# EasyEDA Pro project Environmental_PCB_Group5.epro

# Schematic Schematic1
Board Name: Board1; Create Date: 2025-10-28; Page Name: P1; Project Name: Environmental PCB; Schematic Name: Schematic1; Update Date: 2025-11-02; Company: EasyEDA.com; Page Size: A4; Version: V1.0
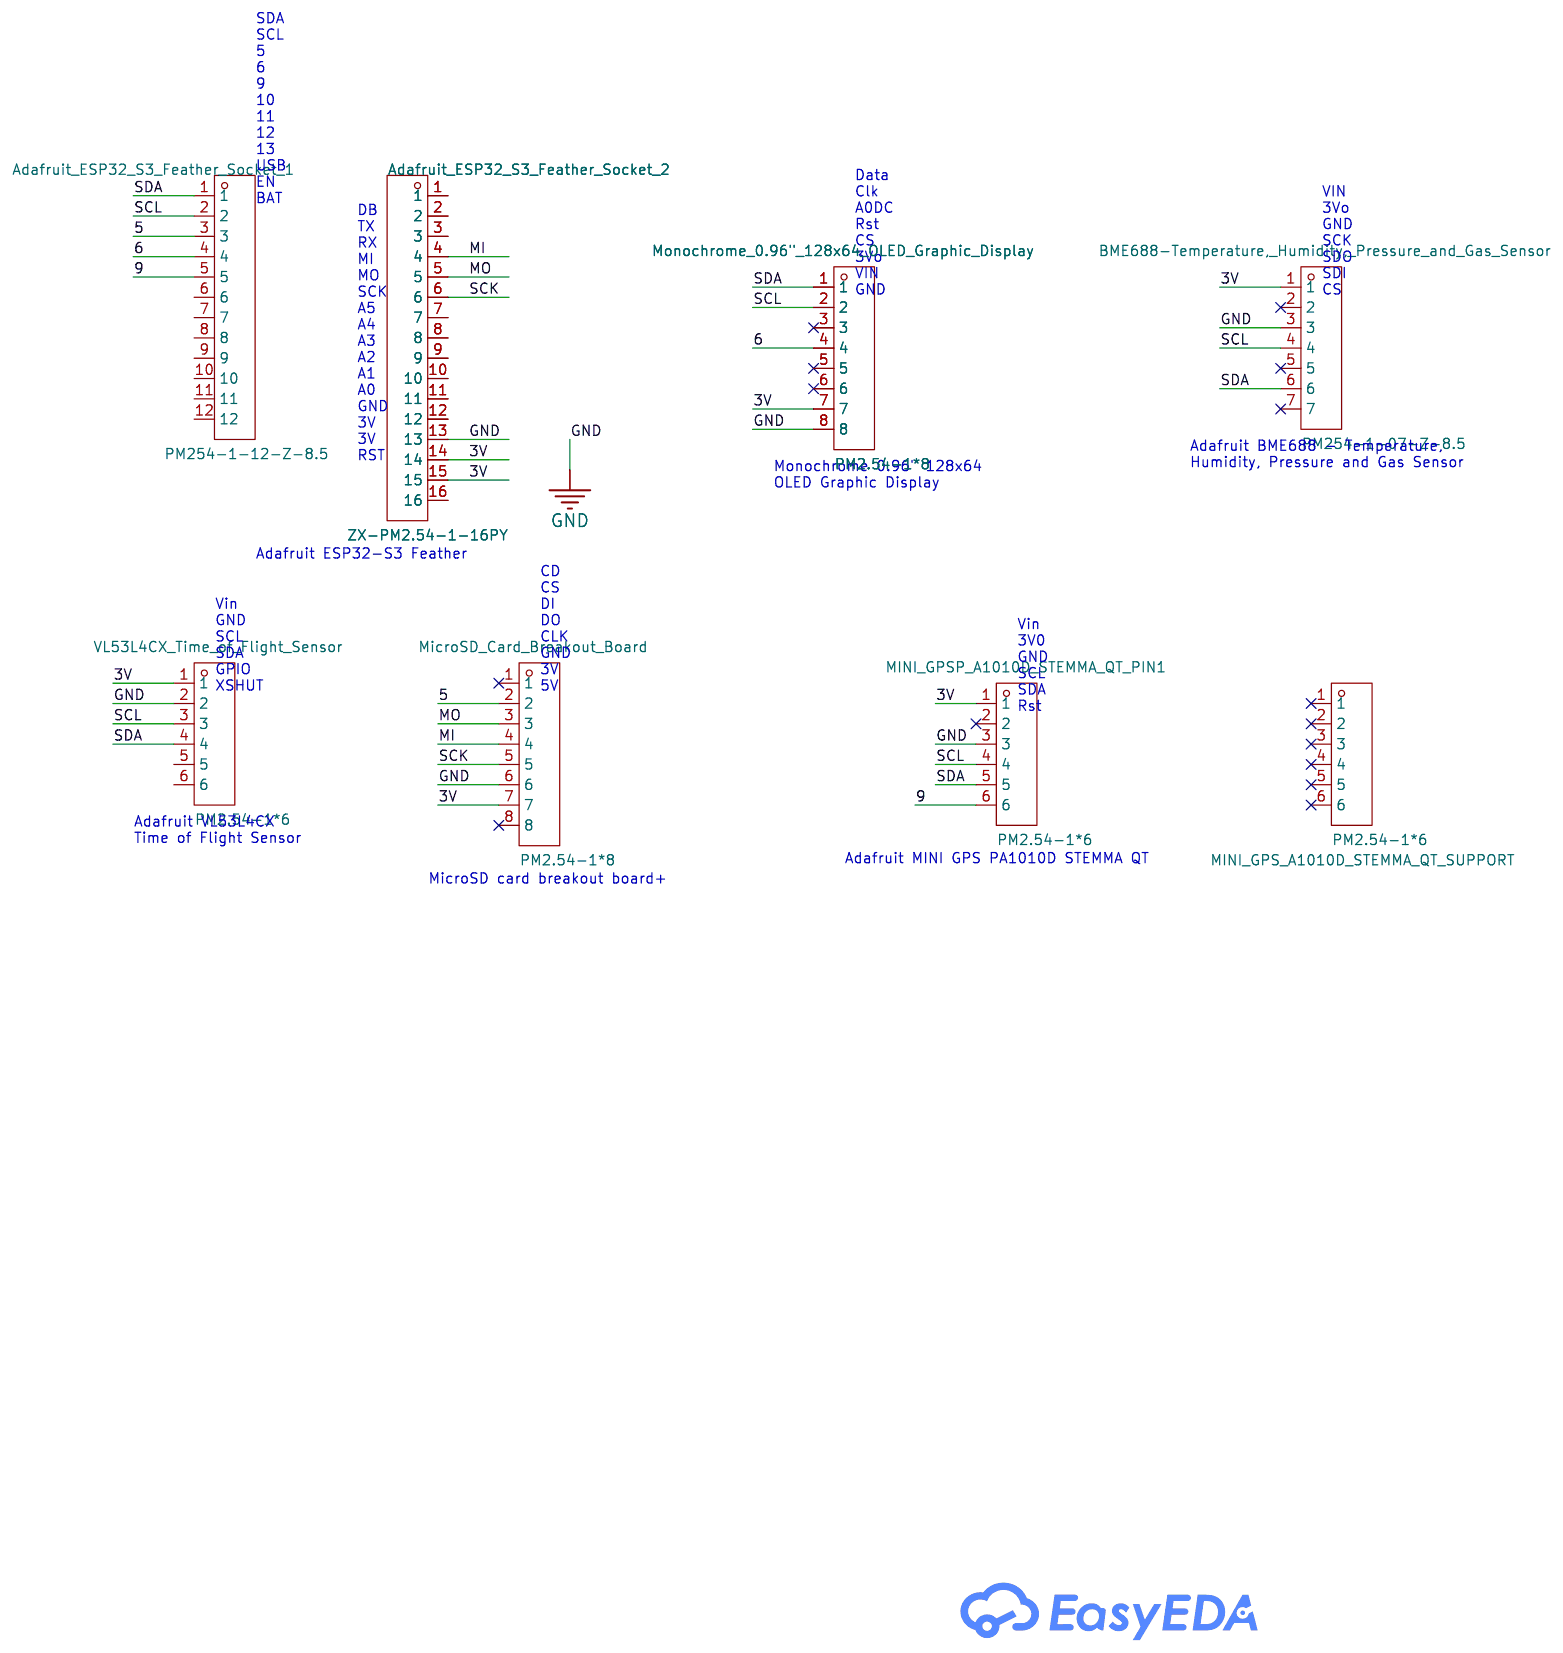
[diagram p0: schematic sheet]

## Parts
Adafruit_ESP32_S3_Feather_Socket_1  PM254-1-12-Z-8.5  [HDR-TH_12P-P2.54-V-F]
Adafruit_ESP32_S3_Feather_Socket_2  ZX-PM2.54-1-16PY  [HDR-TH_16P-P2.54-V-F-1]
BME688-Temperature,_Humidity,_Pressure_and_Gas_Sensor  PM254-1-07-Z-8.5  [HDR-TH_7P-P2.54-V-F]
MicroSD_Card_Breakout_Board  PM2.54-1*8  [HDR-TH_8P-P2.54-V-F]
MINI_GPS_A1010D_STEMMA_QT_SUPPORT  PM2.54-1*6  [HDR-TH_6P-P2.54-V-F_4]
MINI_GPSP_A1010D_STEMMA_QT_PIN1  PM2.54-1*6  [HDR-TH_6P-P2.54-V-F_4]
Monochrome_0.96"_128x64_OLED_Graphic_Display  PM2.54-1*8  [HDR-TH_8P-P2.54-V-F]
VL53L4CX_Time_of_Flight_Sensor  PM2.54-1*6  [HDR-TH_6P-P2.54-V-F_4]

## Library data of the parts
Adafruit_ESP32_S3_Feather_Socket_1 = PM254-1-12-Z-8.5: Holes Structure:1x12P Pitch:2.54mm Row Spacing:- Circular Hole / Square Hole:Square Hole Mounting Type:Through Hole Number of Rows:1 Number of Positions:12P Current Rating:3A Voltage Rating (Max):- Holes Direction:Top Insulation Height:8.5mm Contact Mater; LCSC Part Name: 1x12P 间距:2.54mm 直插; Supplier Part: C2897375; Manufacturer: HCTL(华灿天禄); Supplier Footprint: 插件,P=2.54mm; JLCPCB Part Class: Extended Part; Datasheet: https://item.szlcsc.com/datasheet/PM254-1-12-Z-8.5/3142380.html; Supplier: LCSC; Holes Structure: 1x12P; Pitch: 2.54mm; Circular Hole / Square Hole: Square Hole; Mounting Type: Through Hole; Number of Rows: 1; Number of Positions: 12P; Current Rating: 3A; Holes Direction: Top; Insulation Height: 8.5mm; Contact Material: Copper Alloy; Operating Temperature: -40℃~+105℃
Adafruit_ESP32_S3_Feather_Socket_2 = ZX-PM2.54-1-16PY: Holes Structure:1x16P Pitch:2.54mm Row Spacing:- Circular Hole / Square Hole:Square Hole Mounting Type:Through Hole Number of Rows:1 Number of Positions:16P Current Rating:3A Voltage Rating (Max):- Holes Direction:Top Insulation Height:8.5mm Contact Mater; LCSC Part Name: 1x16P 间距:2.54mm 直插; Supplier Part: C7499334; Manufacturer: Megastar(兆星); Supplier Footprint: 插件,P=2.54mm; JLCPCB Part Class: Extended Part; Datasheet: https://item.szlcsc.com/datasheet/ZX-PM2.54-1-16PY/8573995.html; Supplier: LCSC; Holes Structure: 1x16P; Pitch: 2.54mm; Circular Hole / Square Hole: Square Hole; Mounting Type: Through Hole; Number of Rows: 1; Number of Positions: 16P; Current Rating: 3A; Holes Direction: Top; Insulation Height: 8.5mm; Contact Plating: Gold; Operating Temperature: -40℃~+105℃; PIN Length: 3.2mm
BME688-Temperature,_Humidity,_Pressure_and_Gas_Sensor = PM254-1-07-Z-8.5: Holes Structure:1x7P Pitch:2.54mm Row Spacing:- Circular Hole / Square Hole:Square Hole Mounting Type:Through Hole Number of Rows:1 Number of Positions:7P Current Rating:3A Voltage Rating (Max):- Holes Direction:Top Insulation Height:8.5mm Contact Materia; LCSC Part Name: 1x7P 间距:2.54mm 直插; Supplier Part: C2897370; Manufacturer: HCTL(华灿天禄); Supplier Footprint: 插件,P=2.54mm; JLCPCB Part Class: Extended Part; Datasheet: https://item.szlcsc.com/datasheet/PM254-1-07-Z-8.5/3142375.html; Supplier: LCSC; Holes Structure: 1x7P; Pitch: 2.54mm; Circular Hole / Square Hole: Square Hole; Mounting Type: Through Hole; Number of Rows: 1; Number of Positions: 7P; Current Rating: 3A; Holes Direction: Top; Insulation Height: 8.5mm; Contact Material: Copper Alloy; Operating Temperature: -40℃~+105℃
MicroSD_Card_Breakout_Board Monochrome_0.96"_128x64_OLED_Graphic_Display = PM2.54-1*8: Holes Structure:1x8P Pitch:2.54mm Row Spacing:2.54mm Circular Hole / Square Hole:Square Hole Mounting Type:Through Hole Number of Rows:1 Number of Positions:8P Current Rating:2.5A Holes Direction:Top Insulation Height:8.5mm Operating Temperature:-40℃~+105; LCSC Part Name: 间距:2.54mm 1x8P 直插; Supplier Part: C5224027; Manufacturer: ZHOURI(洲日); Supplier Footprint: 插件,P=2.54mm; JLCPCB Part Class: Extended Part; Datasheet: https://item.szlcsc.com/datasheet/PM2.54-1*8/5925206.html; Supplier: LCSC; Holes Structure: 1x8P; Pitch: 2.54mm; Row Spacing: 2.54mm; Circular Hole / Square Hole: Square Hole; Mounting Type: Through Hole; Number of Rows: 1; Number of Positions: 8P; Current Rating: 2.5A; Holes Direction: Top; Insulation Height: 8.5mm; Operating Temperature: -40℃~+105℃
MINI_GPS_A1010D_STEMMA_QT_SUPPORT MINI_GPSP_A1010D_STEMMA_QT_PIN1 VL53L4CX_Time_of_Flight_Sensor = PM2.54-1*6: Holes Structure:1x6P Pitch:2.54mm Row Spacing:2.54mm Circular Hole / Square Hole:Square Hole Mounting Type:Through Hole Number of Rows:1 Number of Positions:6P Current Rating:2.5A Holes Direction:Top Insulation Height:8.5mm Operating Temperature:-40℃~+105; LCSC Part Name: 间距:2.54mm 1x6P 直插; Supplier Part: C5224026; Manufacturer: ZHOURI(洲日); Supplier Footprint: 插件,P=2.54mm; JLCPCB Part Class: Extended Part; Datasheet: https://item.szlcsc.com/datasheet/PM2.54-1*6/5925205.html; Supplier: LCSC; Holes Structure: 1x6P; Pitch: 2.54mm; Row Spacing: 2.54mm; Circular Hole / Square Hole: Square Hole; Mounting Type: Through Hole; Number of Rows: 1; Number of Positions: 6P; Current Rating: 2.5A; Holes Direction: Top; Insulation Height: 8.5mm; Operating Temperature: -40℃~+105℃

## Nets
3V: Adafruit_ESP32_S3_Feather_Socket_2.14 Adafruit_ESP32_S3_Feather_Socket_2.15 BME688-Temperature,_Humidity,_Pressure_and_Gas_Sensor.1 MicroSD_Card_Breakout_Board.7 MINI_GPSP_A1010D_STEMMA_QT_PIN1.1 Monochrome_0.96"_128x64_OLED_Graphic_Display.7 VL53L4CX_Time_of_Flight_Sensor.1
GND: Adafruit_ESP32_S3_Feather_Socket_2.13 BME688-Temperature,_Humidity,_Pressure_and_Gas_Sensor.3 MicroSD_Card_Breakout_Board.6 MINI_GPSP_A1010D_STEMMA_QT_PIN1.3 Monochrome_0.96"_128x64_OLED_Graphic_Display.8 VL53L4CX_Time_of_Flight_Sensor.2
5: Adafruit_ESP32_S3_Feather_Socket_1.3 MicroSD_Card_Breakout_Board.2
6: Adafruit_ESP32_S3_Feather_Socket_1.4 Monochrome_0.96"_128x64_OLED_Graphic_Display.4
9: Adafruit_ESP32_S3_Feather_Socket_1.5 MINI_GPSP_A1010D_STEMMA_QT_PIN1.6
MI: Adafruit_ESP32_S3_Feather_Socket_2.4 MicroSD_Card_Breakout_Board.4
MO: Adafruit_ESP32_S3_Feather_Socket_2.5 MicroSD_Card_Breakout_Board.3
SCK: Adafruit_ESP32_S3_Feather_Socket_2.6 MicroSD_Card_Breakout_Board.5
SCL: Adafruit_ESP32_S3_Feather_Socket_1.2 BME688-Temperature,_Humidity,_Pressure_and_Gas_Sensor.4 MINI_GPSP_A1010D_STEMMA_QT_PIN1.4 Monochrome_0.96"_128x64_OLED_Graphic_Display.2 VL53L4CX_Time_of_Flight_Sensor.3
SDA: Adafruit_ESP32_S3_Feather_Socket_1.1 BME688-Temperature,_Humidity,_Pressure_and_Gas_Sensor.6 MINI_GPSP_A1010D_STEMMA_QT_PIN1.5 Monochrome_0.96"_128x64_OLED_Graphic_Display.1 VL53L4CX_Time_of_Flight_Sensor.4

Not connected (* = marked no-connect by the designer): Adafruit_ESP32_S3_Feather_Socket_1 6 7 8 9 10 11 12; Adafruit_ESP32_S3_Feather_Socket_2 1 2 3 7 8 9 10 11 12 16; BME688-Temperature,_Humidity,_Pressure_and_Gas_Sensor 2* 5* 7*; MicroSD_Card_Breakout_Board 1* 8*; MINI_GPS_A1010D_STEMMA_QT_SUPPORT 1* 2* 3* 4* 5* 6*; MINI_GPSP_A1010D_STEMMA_QT_PIN1 2*; Monochrome_0.96"_128x64_OLED_Graphic_Display 3* 5* 6*; VL53L4CX_Time_of_Flight_Sensor 5 6

## Notes on the sheet
- SDA
  SCL
  5
  6
  9
  10
  11
  12
  13
  USB
  EN
  BAT
- DB
  TX
  RX
  MI
  MO
  SCK
  A5
  A4
  A3
  A2
  A1
  A0
  GND
  3V
  3V
  RST
- Data
  Clk
  A0DC
  Rst
  CS
  3Vo
  VIN
  GND
- VIN
  3Vo
  GND
  SCK
  SDO
  SDI
  CS
- Adafruit BME688 - Temperature,
  Humidity, Pressure and Gas Sensor
- Monochrome 0.96" 128x64
  OLED Graphic Display
- Adafruit ESP32-S3 Feather
- Vin
  GND
  SCL
  SDA
  GPIO
  XSHUT
- CD
  CS
  DI
  DO
  CLK
  GND
  3V
  5V
- Vin
  3V0
  GND
  SCL
  SDA
  Rst
- Adafruit VL53L4CX
  Time of Flight Sensor
- MicroSD card breakout board+
- Adafruit MINI GPS PA1010D STEMMA QT

# Board PCB1
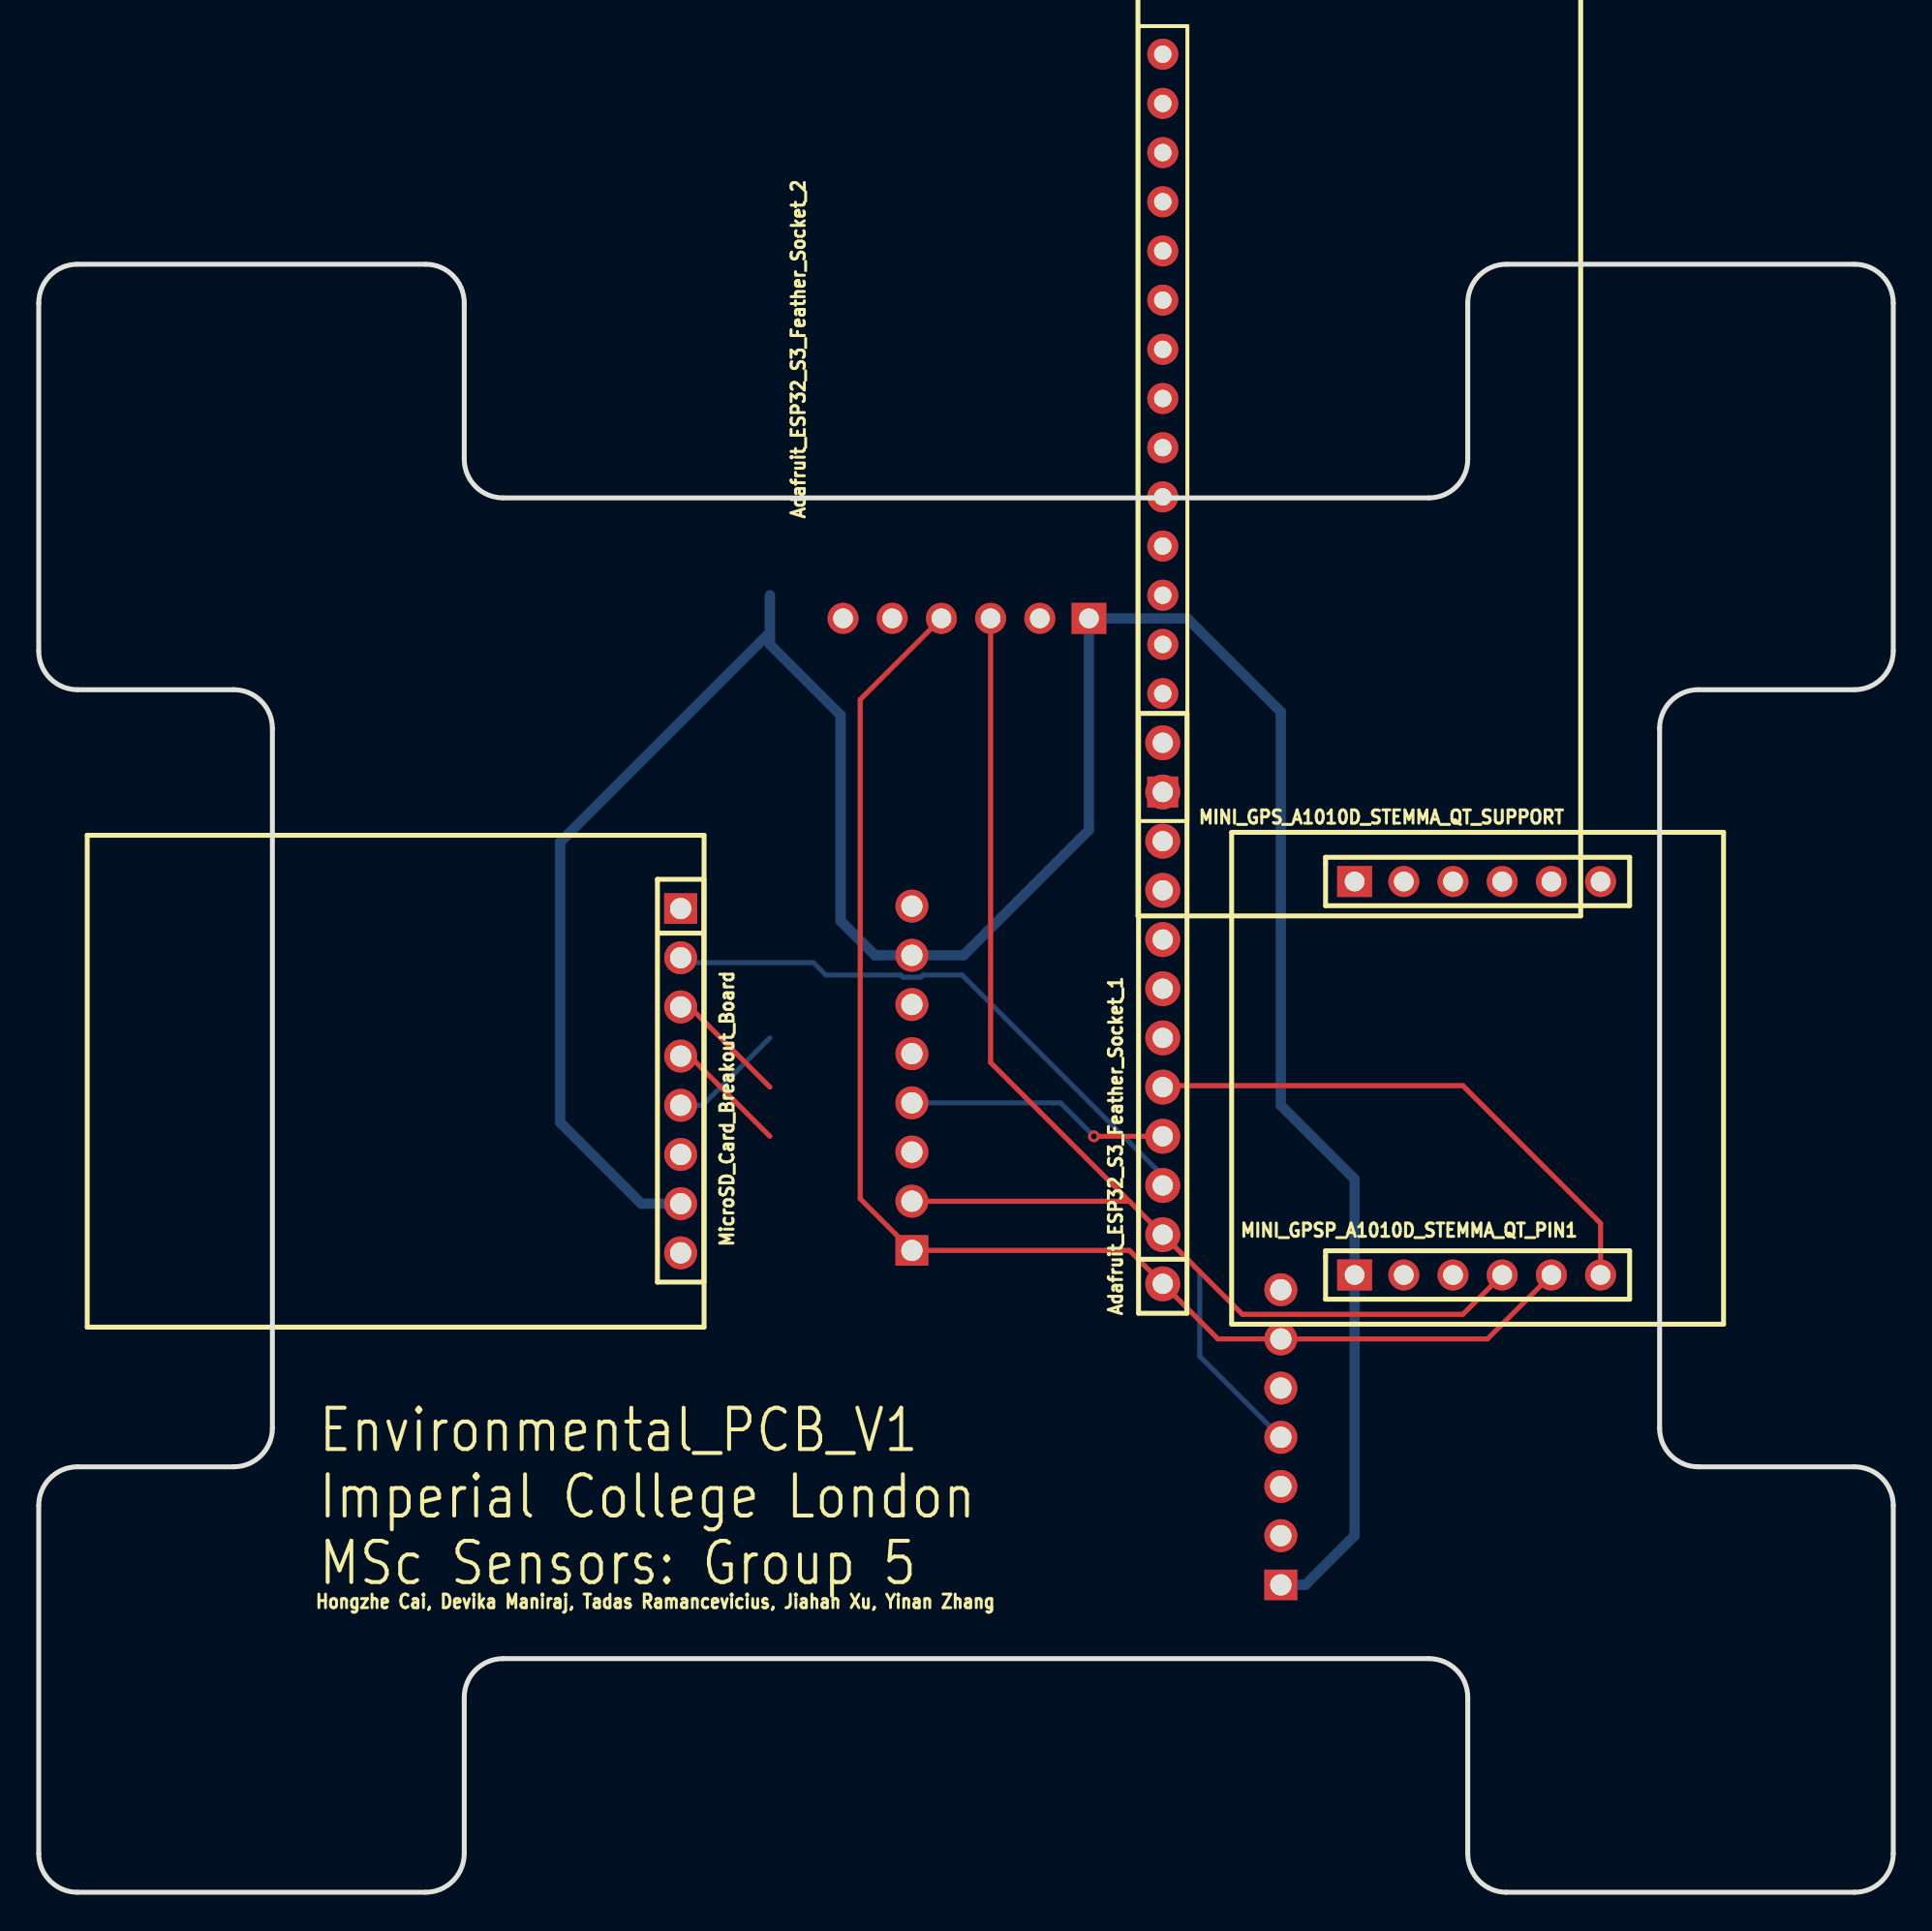
[diagram p1: board, top side]
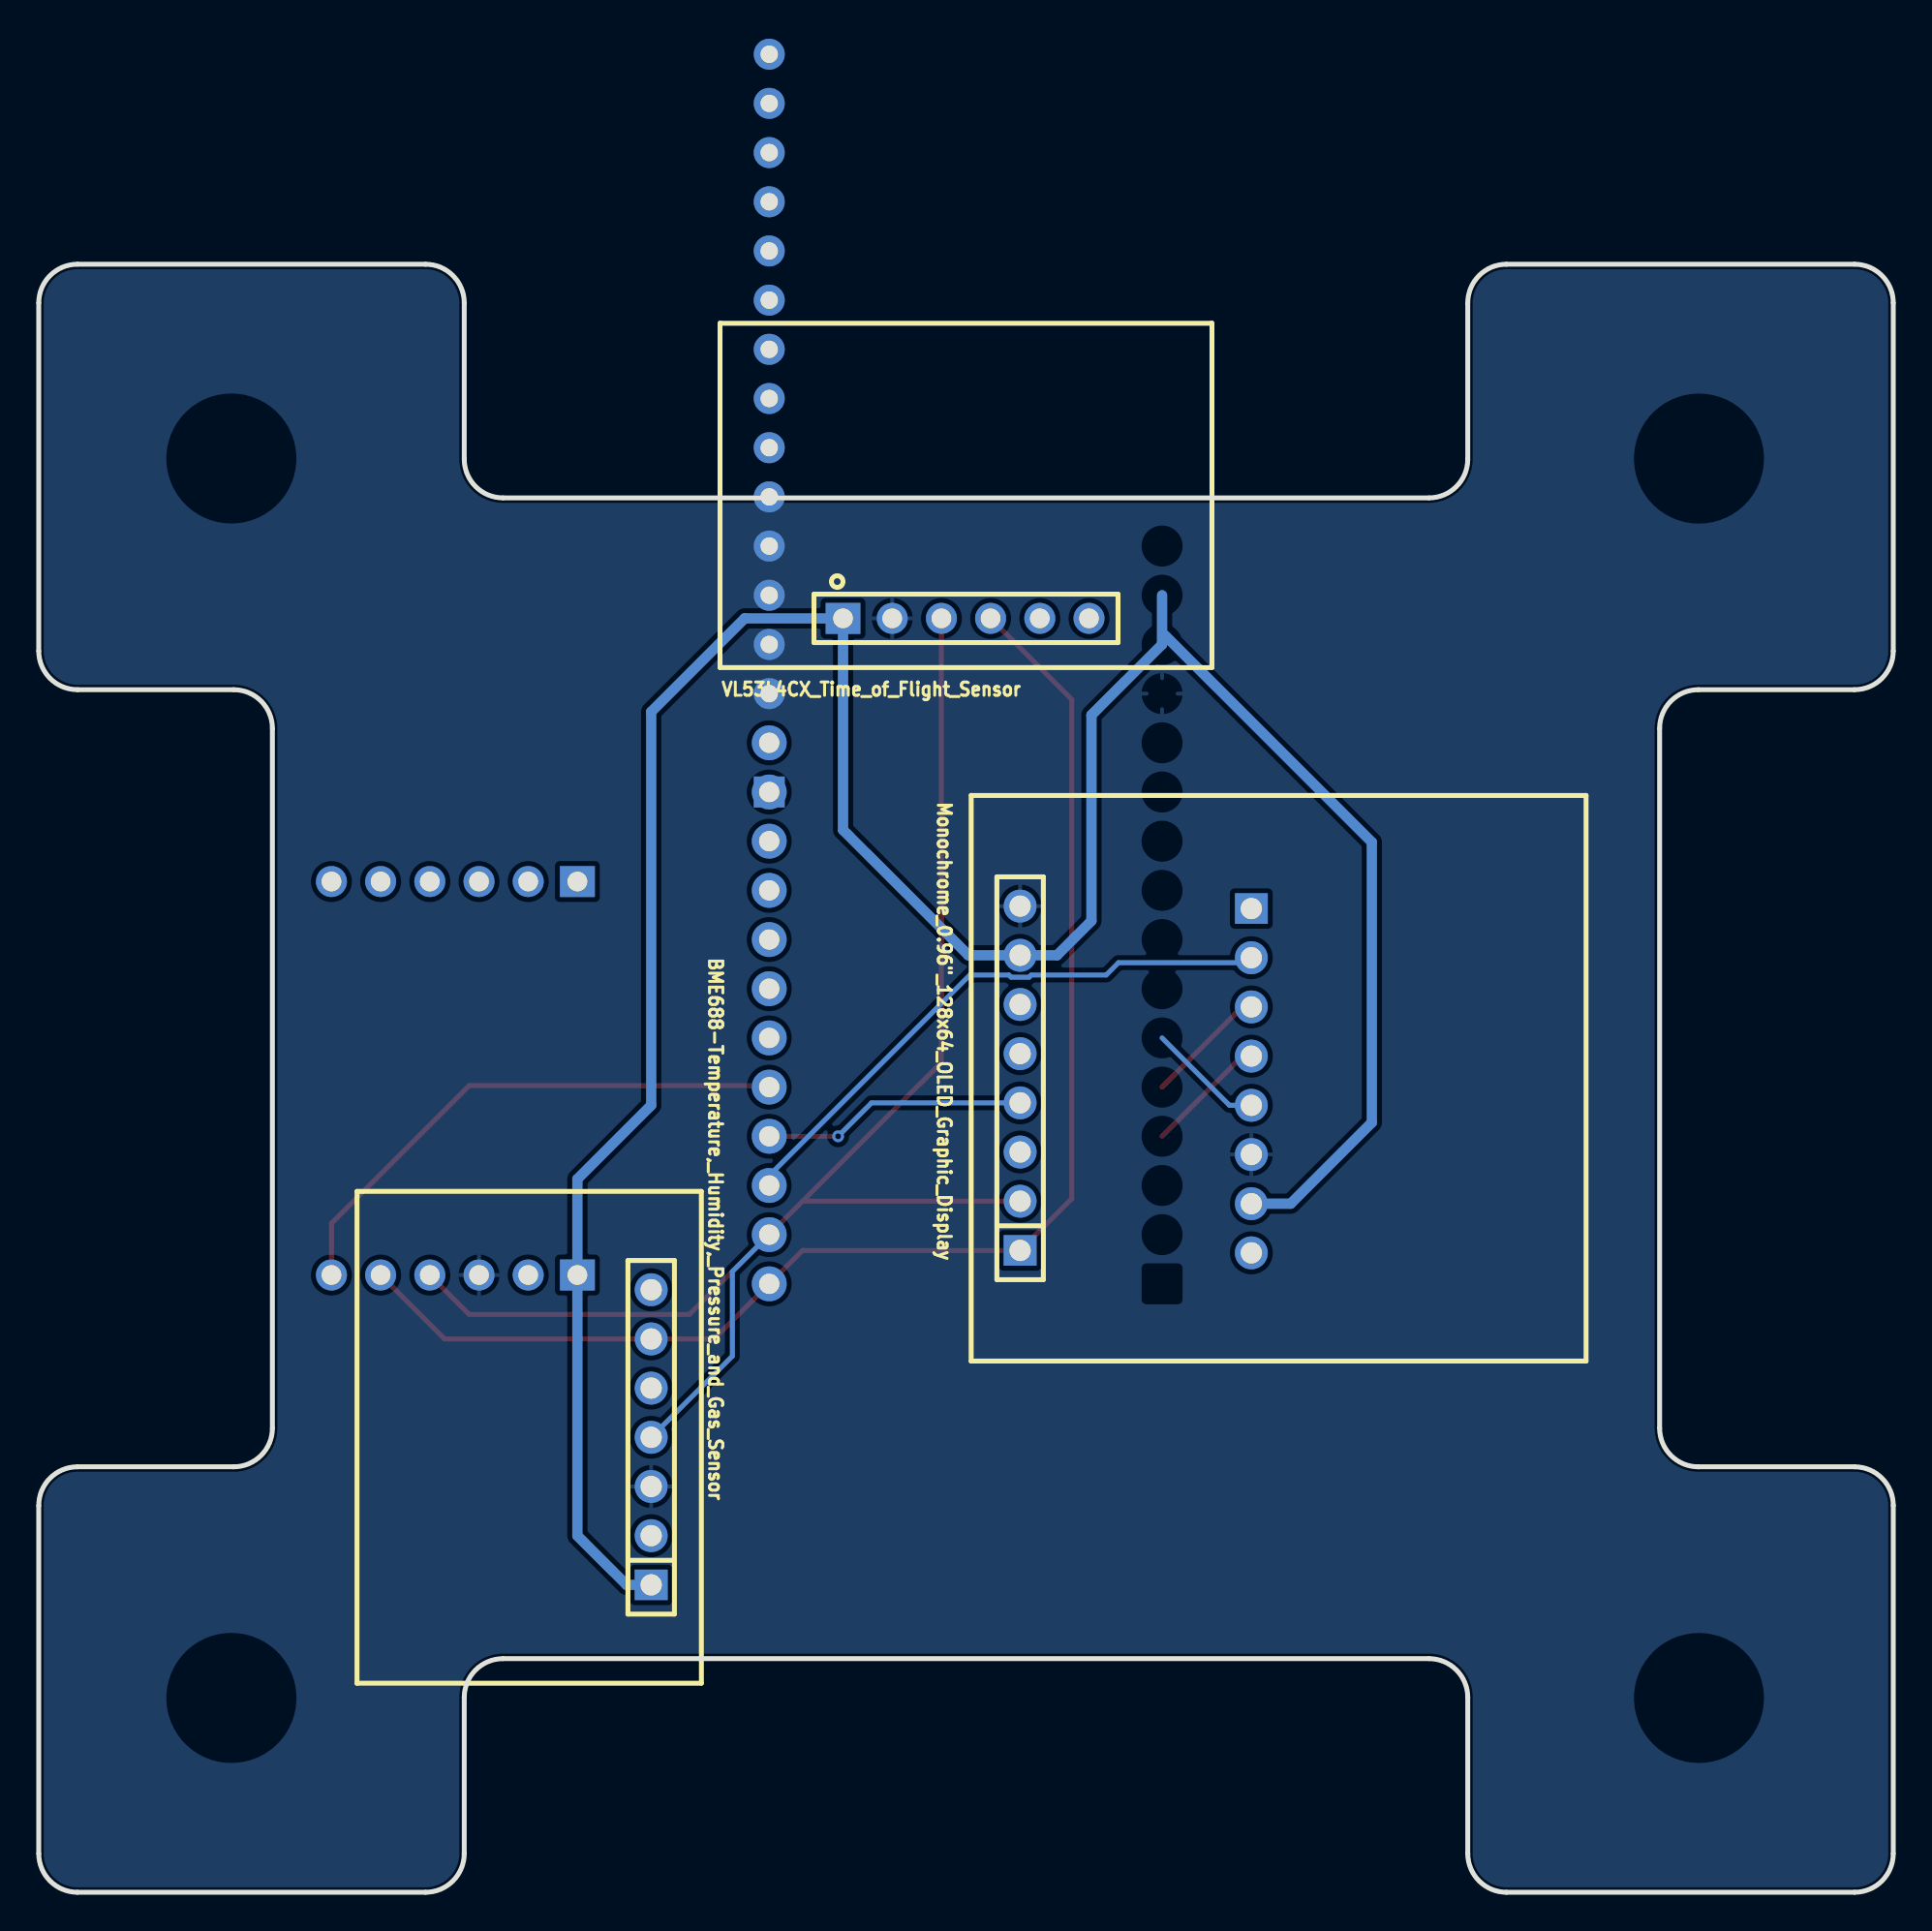
[diagram p2: board, bottom side, seen from below]

Outline 95.76 x 84.07 mm; copper layers: Top Layer, Bottom Layer. Coordinates in mm from the lower left corner of the outline.
Outline path: 0,82.07 arc(0.59,83.49) 2,84.07 19.97,84.07 arc(21.39,83.49) 21.97,82.07 21.97,74.01 arc(22.56,72.59) 23.97,72.01 71.79,72.01 arc(73.2,72.59) 73.79,74.01 73.79,82.07 arc(74.37,83.49) 75.79,84.07 93.76,84.07 arc(95.17,83.49) 95.76,82.07 95.76,64.1 arc(95.17,62.69) 93.76,62.1 85.69,62.1 arc(84.28,61.52) 83.69,60.1 83.69,23.97 arc(84.28,22.56) 85.69,21.97 93.76,21.97 arc(95.17,21.39) 95.76,19.97 95.76,2 arc(95.17,0.59) 93.76,0 75.79,0 arc(74.37,0.59) 73.79,2 73.79,10.06 arc(73.2,11.48) 71.79,12.06 23.97,12.06 arc(22.56,11.48) 21.97,10.06 21.97,2 arc(21.39,0.59) 19.97,0 2,0 arc(0.59,0.59) 0,2 0,19.97 arc(0.59,21.39) 2,21.97 10.06,21.97 arc(11.48,22.56) 12.06,23.97 12.06,60.1 arc(11.48,61.52) 10.06,62.1 2,62.1 arc(0.59,62.69) 0,64.1 0,82.07
Stack: Top Layer 0.035mm / Dielectric1 1.51mm FR4 er 4.5 / Bottom Layer 0.035mm

## Design rules (mm)
template: JLCPCB Capability(Two Layers Board)
spacing copperThickness1oz (default): track to track 0.102, other pairs 0.152 to 0.3
spacing copperThickness2oz: track to track 0.203, other pairs 0.152 to 0.3
track width copperThickness1oz (default): min 0.127, default 0.254, max 2.54
track width copperThickness2oz: min 0.203, default 0.254, max 2.54
differential pair differentialPair (default): width min 0.127, default 0.254, max 2.54; gap min 0.152, default 0.152
via viaSize (default): diameter min 0.5, default 0.61, max 10; hole min 0.3, default 0.305, max 6.3

## Placement (name value [footprint] x y rotation side)
Adafruit_ESP32_S3_Feather_Socket_1  PM254-1-12-Z-8.5  [HDR-TH_12P-P2.54-V-F]  58.04 45.39 90 top
Adafruit_ESP32_S3_Feather_Socket_2  ZX-PM2.54-1-16PY  [HDR-TH_16P-P2.54-V-F-1]  58.04 75.82 270 top
BME688-Temperature,_Humidity,_Pressure_and_Gas_Sensor  PM254-1-07-Z-8.5  [HDR-TH_7P-P2.54-V-F]  64.13 23.49 90 bottom
MicroSD_Card_Breakout_Board  PM2.54-1*8  [HDR-TH_8P-P2.54-V-F]  33.15 41.91 270 top
MINI_GPS_A1010D_STEMMA_QT_SUPPORT  PM2.54-1*6  [HDR-TH_6P-P2.54-V-F_4]  74.29 52.2 0 top
MINI_GPSP_A1010D_STEMMA_QT_PIN1  PM2.54-1*6  [HDR-TH_6P-P2.54-V-F_4]  74.29 31.88 0 top
Monochrome_0.96"_128x64_OLED_Graphic_Display  PM2.54-1*8  [HDR-TH_8P-P2.54-V-F]  45.09 42.04 90 bottom
VL53L4CX_Time_of_Flight_Sensor  PM2.54-1*6  [HDR-TH_6P-P2.54-V-F_4]  47.88 65.79 180 bottom

## Footprints (pads in the part's own frame, mm; a bottom-side part is the same pattern mirrored in y, then rotated)
HDR-TH_6P-P2.54-V-F_4
  rect 1.8x1.6 hole 1.02: 1(-6.35,0)
  round 1.6 hole 1.02: 2(-3.81,0) 3(-1.27,0) 4(1.27,0) 5(3.81,0) 6(6.35,0)
HDR-TH_7P-P2.54-V-F
  rect 1.575x1.7 hole 1.1: 1(-7.62,0)
  round 1.7 hole 1.1: 2(-5.08,0) 3(-2.54,0) 4(0,0) 5(2.54,0) 6(5.08,0) 7(7.62,0)
HDR-TH_8P-P2.54-V-F
  rect 1.575x1.7 hole 1.1: 1(-8.89,0)
  round 1.7 hole 1.1: 2(-6.35,0) 3(-3.81,0) 4(-1.27,0) 5(1.27,0) 6(3.81,0) 7(6.35,0) 8(8.89,0)
HDR-TH_12P-P2.54-V-F
  round 1.8 hole 1.05: 1(-13.97,0) 2(-11.43,0) 3(-8.89,0) 4(-6.35,0) 5(-3.81,0) 6(-1.27,0) 7(1.27,0) 8(3.81,0) 9(6.35,0) 10(8.89,0) 11(11.43,0) 12(13.97,0)
HDR-TH_16P-P2.54-V-F-1
  rect 1.6x1.6 hole 0.9: 1(19,0.001)
  round 1.6 hole 0.9: 2(16.459,0.001) 3(13.919,0.001) 4(11.38,0.001) 5(8.839,0.001) 6(6.3,0.001) 7(3.76,0.001) 8(1.22,0.001) 9(-1.321,0.001) 10(-3.861,0.001) 11(-6.401,0.001) 12(-8.941,0.001) 13(-11.48,0.001) 14(-14.021,0.001) 15(-16.561,0.001) 16(-19.101,0.001)

## Nets
As in the schematic.

Pads without a net: Adafruit_ESP32_S3_Feather_Socket_1 6 7 8 9 10 11 12; Adafruit_ESP32_S3_Feather_Socket_2 1 2 3 7 8 9 10 11 12 16; BME688-Temperature,_Humidity,_Pressure_and_Gas_Sensor 2 5 7; MicroSD_Card_Breakout_Board 1 8; MINI_GPS_A1010D_STEMMA_QT_SUPPORT 1 2 3 4 5 6; MINI_GPSP_A1010D_STEMMA_QT_PIN1 2; Monochrome_0.96"_128x64_OLED_Graphic_Display 3 5 6; VL53L4CX_Time_of_Flight_Sensor 5 6

## Via types
v1: diameter 0.61, hole 0.305, Top Layer to Bottom Layer, 1 via

## Routing (per net, layer and track width the routed paths; a pad name or vN(x,y) marks a point on that pad's centre or on a via; arc(x,y) is an arc through that point)
3V: length 143.9
  Bottom Layer w0.53: 37.75,66.98 37.75,64.44 41.4,60.79 41.4,50.16 43.18,48.39 Monochrome_0.96"_128x64_OLED_Graphic_Display.7 47.75,48.39 54.23,54.86 54.23,65.79 59.31,65.79 64.13,60.96 64.13,40.64 67.94,36.83 MINI_GPSP_A1010D_STEMMA_QT_PIN1.1 67.94,18.41 65.41,15.88 BME688-Temperature,_Humidity,_Pressure_and_Gas_Sensor.1 ; 37.59,64.9 26.92,54.23 26.92,39.75 31.12,35.56 MicroSD_Card_Breakout_Board.7
5: length 30.2
  Bottom Layer w0.254: MicroSD_Card_Breakout_Board.2 33.4,48.01 40,48.01 40.64,47.37 44.5,47.37 44.62,47.26 45.55,47.26 45.67,47.37 47.68,47.37 58.04,37.01 Adafruit_ESP32_S3_Feather_Socket_1.3
6: length 13.7
  Top Layer w0.254: Adafruit_ESP32_S3_Feather_Socket_1.4 v1(54.48,39.04)
  Bottom Layer w0.254: v1(54.48,39.04) 52.76,40.77 Monochrome_0.96"_128x64_OLED_Graphic_Display.4
9: length 28.3
  Top Layer w0.254: Adafruit_ESP32_S3_Feather_Socket_1.5 58.12,41.66 73.53,41.66 80.65,34.54 80.65,31.88
MI: length 6.3
  Top Layer w0.254: 37.75,39.04 33.61,43.18 MicroSD_Card_Breakout_Board.4
MO: length 6.3
  Top Layer w0.254: MicroSD_Card_Breakout_Board.3 33.61,45.72 37.75,41.58
SCK: length 6
  Bottom Layer w0.254: MicroSD_Card_Breakout_Board.5 34.28,40.64 37.75,44.12
SCL: length 79.8
  Top Layer w0.254: 56.31,35.69 Monochrome_0.96"_128x64_OLED_Graphic_Display.2 ; 56.31,35.69 49.15,42.85 VL53L4CX_Time_of_Flight_Sensor.3 ; 56.31,35.69 62.15,29.84 73.53,29.84 MINI_GPSP_A1010D_STEMMA_QT_PIN1.4
  Bottom Layer w0.254: 58.04,33.96 59.94,32.05 59.94,27.69 BME688-Temperature,_Humidity,_Pressure_and_Gas_Sensor.4
SDA: length 71.8
  Top Layer w0.254: 46.61,65.79 42.42,61.59 42.42,35.81 Monochrome_0.96"_128x64_OLED_Graphic_Display.1 56.31,33.15 Adafruit_ESP32_S3_Feather_Socket_1.1 60.88,28.57 BME688-Temperature,_Humidity,_Pressure_and_Gas_Sensor.6 74.8,28.57 MINI_GPSP_A1010D_STEMMA_QT_PIN1.5

## Copper pours and planes (outline as drawn; the poured copper is in the pictures)
GND on Bottom Layer: -0.25,84.84 96.52,84.84 96.52,-1.27 -0.25,-1.27

## Text on the board
Top Silkscreen Layer: Hongzhe Cai, Devika Maniraj, Tadas Ramancevicius, Jiahan Xu, Yinan Zhang | Environmental_PCB_V1 / Imperial College London / MSc Sensors: Group 5
